# Altium schematic sheet SCH.SchDoc
size A4; SheetNumber: 1; SheetTotal: 1
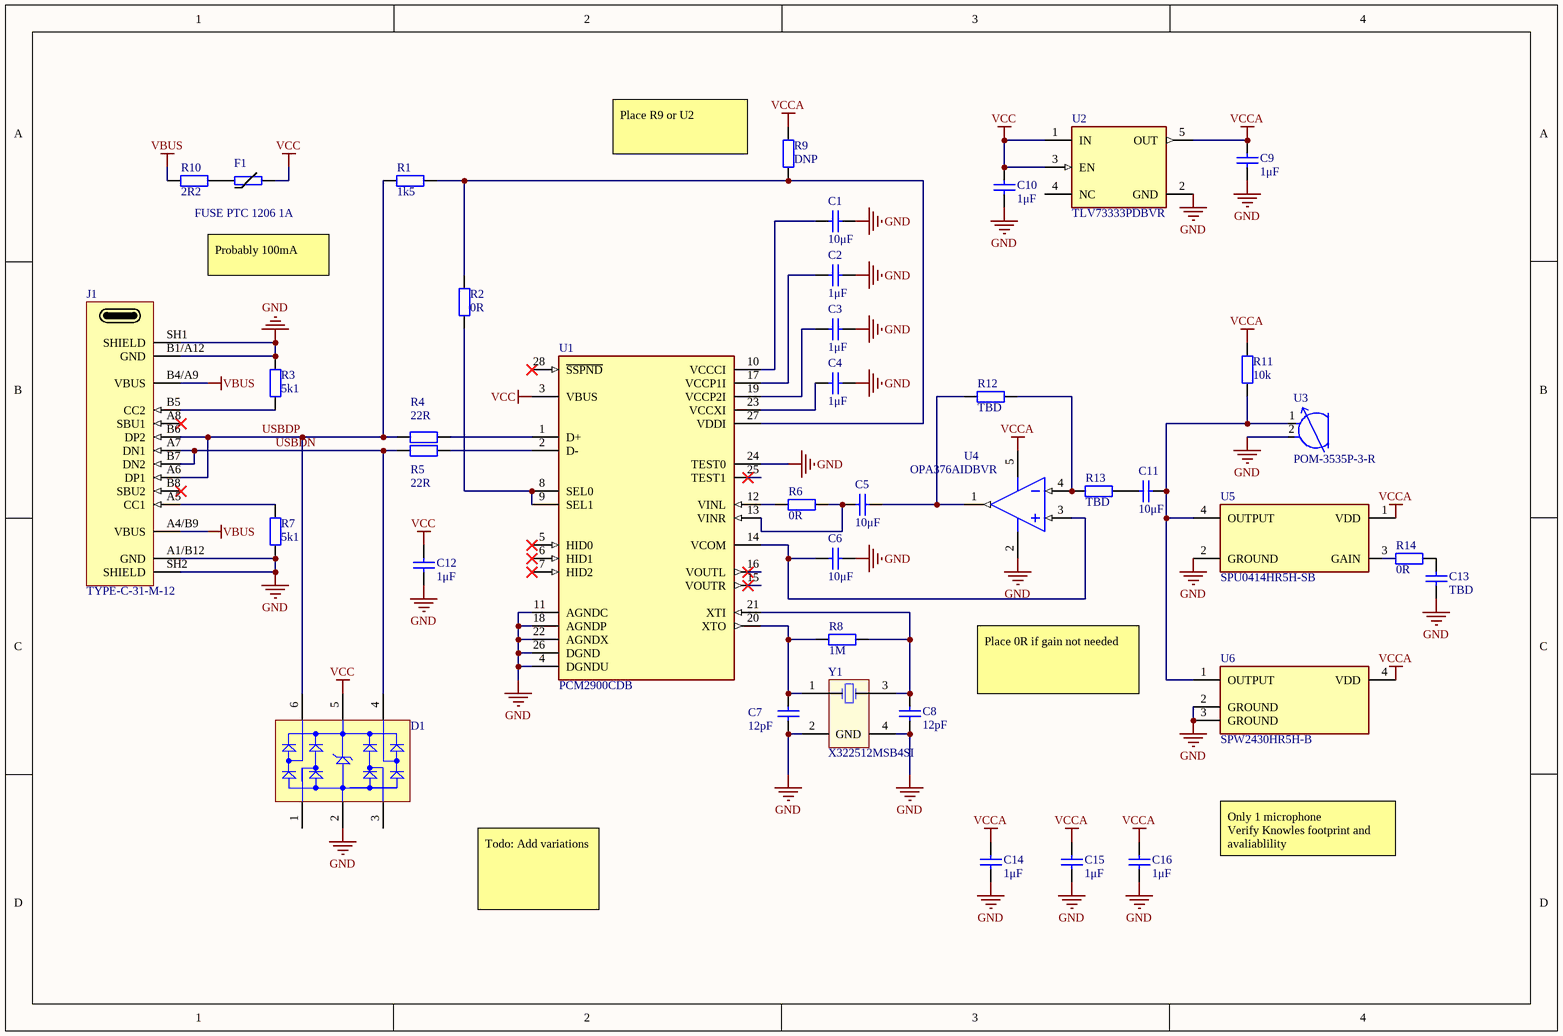
[diagram p0: SCH.SchDoc]

## Parts
C1  value 10μF  [CAPC1206N]  (hidden comment: Cap)
C2  value 1μF  [CAPC0402N]  (hidden comment: Cap)
C3  value 1μF  [CAPC0402N]  (hidden comment: Cap)
C4  value 1μF  [CAPC0402N]  (hidden comment: Cap)
C5  value 10μF  [CAPC1206N]  (hidden comment: Cap)
C6  value 10μF  [CAPC1206N]  (hidden comment: Cap)
C7  value 12pF  [CAPC0402N]  (hidden comment: Cap)
C8  value 12pF  [CAPC0402N]  (hidden comment: Cap)
C9  value 1μF  [CAPC0402N]  (hidden comment: Cap)
C10  value 1μF  [CAPC0402N]  (hidden comment: Cap)
C11  value 10μF  [CAPC1206N]  (hidden comment: Cap)
C12  value 1μF  [CAPC0402N]  (hidden comment: Cap)
C13  value TBD  [CAPC0402N]  (hidden comment: Cap)
C14  value 1μF  [CAPC0402N]  (hidden comment: Cap)
C15  value 1μF  [CAPC0402N]  (hidden comment: Cap)
C16  value 1μF  [CAPC0402N]  (hidden comment: Cap)
D1  (no value)  [SMTC-SOT23-6_V]
F1  FUSE PTC 1206 1A  [FUSE1206N]
J1  TYPE-C-31-M-12  [TYPE-C-31-M-12]
R1  value 1k5  [RESC0402N]  (hidden comment: Res)
R2  value 0R  [RESC0402N]  (hidden comment: Res)
R3  value 5k1  [RESC0402N]  (hidden comment: 5K1 0402)
R4  value 22R  [RESC0402N]  (hidden comment: Res)
R5  value 22R  [RESC0402N]  (hidden comment: Res)
R6  value 0R  [RESC0402N]  (hidden comment: Res)
R7  value 5k1  [RESC0402N]  (hidden comment: 5K1 0402)
R8  value 1M  [RESC0402N]  (hidden comment: Res)
R9  value DNP  [RESC0402N]  (hidden comment: Res)
R10  value 2R2  [RESC0805N]  (hidden comment: Res)
R11  value 10k  [RESC0402N]  (hidden comment: Res)
R12  value TBD  [RESC0402N]  (hidden comment: Res)
R13  value TBD  [RESC0402N]  (hidden comment: Res)
R14  value 0R  [RESC0402N]  (hidden comment: Res)
U1  PCM2900CDB  [FP-DB0028A-IPC_A]
U2  TLV73333PDBVR  [FP-DBV0005A-MFG]
U3  POM-3535P-3-R  [FP-POM-3535P-3-R-MFG]
U4  OPA376AIDBVR  [DBV0005A_L]
U5  SPU0414HR5H-SB  [FP-SPU0414HR5H-SB-MFG]
U6  SPW2430HR5H-B  [FP-SPW2430HR5H-B-MFG]
Y1  X322512MSB4SI  [osccc340x270x100m]

## Nets
GND: C1.2 C2.2 C3.2 C4.2 C6.2 C7.1 C8.1 C9.1 C10.1 C12.1 C13.1 C14.1 C15.1 C16.1 D1.2(GND) J1.A1/B12(GND) J1.B1/A12(GND) J1.SH1(SHIELD) J1.SH2(SHIELD) R3.2 R7.1 U1.4(DGNDU) U1.11(AGNDC) U1.18(AGNDP) U1.22(AGNDX) U1.24(TEST0) U1.26(DGND) U2.2(GND) U3.2(C) U4.2(V-) U5.2(GROUND) U6.2(GROUND) U6.3(GROUND) Y1.2 Y1.4(GND)
VBUS: J1.A4/B9(VBUS) J1.B4/A9(VBUS) R10.1
VCC: C10.2 C12.2 D1.5(VBUS) F1.2 U1.3(VBUS) U2.1(IN) U2.3(EN)
VCCA: C9.2 C14.2 C15.2 C16.2 R9.2 R11.2 U2.5(OUT) U4.5(V+) U5.1(VDD) U6.4(VDD)
USBDN: D1.4(I/O_3) J1.A7(DN1) J1.B7(DN2) R5.1
USBDP: D1.6(I/O_4) J1.A6(DP1) J1.B6(DP2) R1.1 R4.1
NetC1_1: C1.1 U1.10(VCCCI)
NetC2_1: C2.1 U1.17(VCCP1I)
NetC3_1: C3.1 U1.19(VCCP2I)
NetC4_1: C4.1 U1.23(VCCXI)
NetC5_1: C5.1 R6.2 U1.13(VINR)
NetC5_2: C5.2 R12.1 U4.1(OUT)
NetC6_1: C6.1 U1.14(VCOM) U4.3(IN+)
NetC7_2: C7.2 R8.1 U1.20(XTO) Y1.1(OSC1)
NetC8_2: C8.2 R8.2 U1.21(XTI) Y1.3(OSC2)
NetC11_1: C11.1 R13.2
NetC11_2: C11.2 R11.1 U3.1(A) U5.4(OUTPUT) U6.1(OUTPUT)
NetC13_2: C13.2 R14.2
NetF1_1: F1.1 R10.2
NetJ1_A5: J1.A5(CC1) R7.2
NetJ1_B5: J1.B5(CC2) R3.1
NetR1_2: R1.2 R2.2 R9.1 U1.27(VDDI)
NetR2_1: R2.1 U1.8(SEL0) U1.9(SEL1)
NetR4_2: R4.2 U1.1(D+)
NetR5_2: R5.2 U1.2(D-)
NetR6_1: R6.1 U1.12(VINL)
NetR12_2: R12.2 R13.1 U4.4(IN-)
NetR14_1: R14.1 U5.3(GAIN)

Not connected (* = marked no-connect by the designer): D1 1(I/O_1) 3(I/O_2); J1 A8(SBU1)* B8(SBU2)*; U1 5(HID0)* 6(HID1)* 7(HID2)* 15(VOUTR)* 16(VOUTL)* 25(TEST1)* 28(~{SSPND})*; U2 4(NC)

## Notes on the sheet
- (near R9) Place R9 or U2
- Probably 100mA
- Place 0R if gain not needed
- Only 1 microphone
  Verify Knowles footprint and avaliablility
- Todo: Add variations

## Library data of the parts
C1 C5 C6 C11 = C13585: Multilayer Ceramic Capacitors MLCC - SMD/SMT 10uF 50V 1206 RoHS; MFR: CL31A106KBHNNNE; Manufacturer: Samsung Electro-Mechanics; Basic/Extended: B; Temperature Coefficient: X5R; pf: 10000000; LCSC: C13585; Price: 0.055$/unit; Package: 1206; Voltage - Rated: 50V
C2-C4 C9 C10 C12 C14-C16 = C52923: Multilayer Ceramic Capacitors MLCC - SMD/SMT 1uF 25V 0402 RoHS; MFR: CL05A105KA5NQNC; Manufacturer: Samsung Electro-Mechanics; Basic/Extended: B; Temperature Coefficient: X5R; pf: 1000000; LCSC: C52923; Price: 0.007$/unit; Package: 0402; Voltage - Rated: 25V
C7 C8 C13 = C1547: Multilayer Ceramic Capacitors MLCC - SMD/SMT 12pF 50V 0402 RoHS; MFR: 0402CG120J500NT; Manufacturer: Guangdong Fenghua Advanced Tech; Basic/Extended: B; Temperature Coefficient: C0G; pf: 12; LCSC: C1547; Price: 0.003$/unit; Package: 0402; Voltage - Rated: 50V
D1 = CMP-2000-05358-1: RailClamp(R) Low Capacitance TVS Diode Array, 5 pF, 17.5 VC, -55 to 125 degC, 6-Pin SOT23, RoHS, Tape and Reel; Manufacturer: PROTEK DEVICES; MFR: SRV05-4-P-T7; Basic/Extended: B; LCSC: C85364; Package: SOT-23-6L; Price: 0.14
F1 = 0ZCJ0100FF2E: MANUF: Bel Fuse; Manufacturer: BOURNS; MFR: MF-NSMF050-2; DESCIPTION: PTC FUSE 6V 1A 1206; COMPATIBLES: YES; VALUE: 1000 mA; NoPins: 2; Voltage: 6V; SCH: PTC 6V 1A 1206; Basic/Extended: E; MANUFCODE: 0ZCJ0100FF2E; DIGIKEY: 507-1806-2-ND,507-1806-1-ND,507-1806-6-ND; SMD: YES; mA: 1000 mA; LCSC: C75464; Package: 1206
J1 = TYPE-C-31-M-12: USB TYPE-C 2.0 16 PIN SMD; Manufacturer: Korean Hroparts Elec; Basic/Extended: E; LCSC: C165948; MFR: TYPE-C-31-M-12
R1 = C25867: Chip Resistor - Surface Mount 1.5KOhms ±1% 1/16W 0402 RoHS; MFR: 0402WGF1501TCE; Manufacturer: Uniroyal Elec; B/E: B; LCSC: C25867; Package: '0402
R2 R6 R9 R12-R14 = C17168: Chip Resistor - Surface Mount 0Ohms ±1% 1/16W 0402 RoHS; MFR: 0402WGF0000TCE; Manufacturer: Uniroyal Elec; B/E: B; LCSC: C17168; Package: '0402
R3 R7 = C25905: Chip Resistor - Surface Mount 5.1KOhms ±1% 1/16W 0402 RoHS; MFR: 0402WGF5101TCE; Manufacturer: Uniroyal Elec; B/E: B; LCSC: C25905; Package: '0402; Basic/Extended: B
R4 R5 = C25092: Chip Resistor - Surface Mount 22Ohms ±1% 1/16W 0402 RoHS; MFR: 0402WGF220JTCE; Manufacturer: Uniroyal Elec; B/E: B; LCSC: C25092; Package: '0402
R8 = C26083: Chip Resistor - Surface Mount 1MOhms ±1% 1/16W 0402 RoHS; MFR: 0402WGF1004TCE; Manufacturer: Uniroyal Elec; B/E: B; LCSC: C26083; Package: '0402
R10 = C17521: Chip Resistor - Surface Mount 2.2Ohms ±1% 1/8W 0805 RoHS; MFR: 0805W8F220KT5E; Manufacturer: Uniroyal Elec; B/E: B; LCSC: C17521; Package: '0805
R11 = C25744: Chip Resistor - Surface Mount 10KOhms ±1% 1/16W 0402 RoHS; MFR: 0402WGF1002TCE; Manufacturer: Uniroyal Elec; B/E: B; LCSC: C25744; Package: '0402
U1 = CMP-04894-000011-1: IC STEREO AUD CODEC W/USB 28SSOP; Number of Analog Inputs: 2; Interface: USB; Operating Supply Current: 67mA; Sampling Rate: 48KS/s; Max Supply Voltage: 5.25V; Resolution: 16b; Number of A/D Converters: 1; Operating Supply Voltage: 5V; Signal to Noise Ratio (SNR): 89dB; Lead Free: Lead Free; Case/Package: SSOP; Radiation Hardening: No; Number of ADC Channels: 2; Number of Pins: 28; Series: -; Mount: Surface Mount; Max Operating Temperature: 85°C; Min Operating Temperature: -25°C; Type: General Purpose; Weight: 0.009348oz; Number of DAC Channels: 2; Number of Analog Outputs: 2; RoHS Compliant: Yes; Package Quantity: 50; REACH SVHC: No SVHC; Packaging: Rail/Tube; Number of D/A Converters: 1
U2 = CMP-04917-000053-1: IC REG LINEAR 3.3V 300MA SOT23-5; Manufacturer: Texas Instruments; Max Junction Temp: +125°C; Accuracy Percentage: 1%; Min Supply Voltage: 1.4V; Description: Linear Voltage Regulator IC 1 Output 300mA SOT-23-5; Number Of Outputs: 1; Dropout Voltage: 125mV; Nominal Supply Current: 34uA; Max Supply Voltage: 5.5V; Output Type: Fixed; Standoff Height: 0mm; Digikey Description: IC REG LINEAR 3.3V 300MA SOT23-5; Manufacturer Part Number: TLV73333PDBVR; Temperature Range High: +125°C; Temperature: -40°C to +125°C; Output Current: 300mA; Mouser Description: LDO Voltage Regulators Capacitr-Free 300-mA 5-SOT-23 -40 to 125; Automotive: No; Height: 1.45mm; Device Class L3: Voltage Regulators - Linear; ComponentLink2Description: Datasheet; Device Class L1: Integrated Circuits (ICs); ComponentLink2URL: http://www.ti.com/lit/ds/symlink/tlv733p.pdf; Octopart: https://octopart.com/tlv73333pdbvr-texas+instruments-51080890; Temperature Range Low: -40°C; RoHS: TRUE; Lead Free: Yes; Output Voltage: 3.3V; Package: DBV0005A; Device Class L2: Power Management ICs; Category: IC
U3 = CMP-231723-000001-1: MIC COND ANALOG OMNI -35DB 6MM D; Resistance: 2200R; Direction: Omnidirectional; Impedance: 2.2kR; Shape: Round; Voltage Rating: 2V; Operating Supply Current: 500uA; Packaging: Bulk; Height: 3.7mm; Termination: PC Pins; Depth: 3.7mm; Diameter: 6mm; Mount: Through Hole; Package Quantity: 100; Output Type: Analog
U4 = CMP-0272-00842-3: Precision, Low Noise, Low Iq Operational Amplifier, 2.2 to 5.5 V, -40 to 125 degC, 5-pin SOT23 (DBV5), Green (RoHS & no Sb/Br); Manufacturer: Texas Instruments; Offset Drift(Typ)(uV/C): 0.32; Iq per channel(Max)(mA): 0.95; Vn at 1kHz(Typ)(nV/rtHz): 7.5; Total Supply Voltage(Min)(+5V is 5, +/-5V is 10): 2.2; Number of Channels: 1; Slew Rate(Typ)(V/us): 2; CMRR(Min)(dB): 76; Total Supply Voltage(Max)(+5V is 5, +/-5V is 10): 5.5; Vio (25C)(Max)(mV): 0.025; IIB(Max)(pA): 10; Sub Family: Low Input Bias Current Amp (<=10pA), Low Noise Amp (<=10nV/rtHz), Low Offset Voltage Amplifier (<=500uV), Low Supply Voltage Amplifier (<=2.7V), Precision Amplifier; Code_JEDEC: MO-178; DatasheetVersion: SBOS406F; ComponentLink3Description: Package Specification; PackageVersion: 4073253-4/K, 03/2006; ComponentLink2Description: Datasheet; PackageDescription: 5-Pin Plastic Small Outline, Body 1.6 x 2.9 mm, Pitch 0.95 mm; ComponentLink1URL: http://www.ti.com/; Mounting Technology: Surface Mount; PartNumber: OPA376AIDBVR; ComponentLink1Description: Manufacturer URL; ComponentLink3URL: http://www.ti.com/litv/pdf/mpds018i; PackageReference: DBV0005A; ComponentLink2URL: http://www.ti.com/general/docs/lit/getliterature.tsp?genericPartNumber=OPA376&fileType=pdf; Eco-Plan: Green (RoHS & no Sb/Br)
U5 = CMP-95043-000002-1: MICROPHONE MEMS ANALOG OMNI; Operating Supply Voltage: 3.6V; Operating Supply Current: 350uA; Frequency: 100Hz; Shape: Rectangular; Impedance: 400R; Signal to Noise Ratio (SNR): 59dB; Direction: Omnidirectional; Current Rating: 220uA; Depth: 1.2mm; Output Type: Analog; Termination: SMD/SMT; Width: 2.95mm; Height: 1.2mm; Packaging: Tape and Reel; Length: 3.76mm; Voltage Rating: 3.6V; Package Quantity: 1200
U6 = CMP-95043-000004-1: MICROPHONE MEMS ANALOG OMNI; Shape: Rectangular; Impedance: 450R; Direction: Omnidirectional; Operating Supply Current: 110uA; Width: 2.5mm; Output Type: Analog; Height: 1.1mm; Termination: Solder; Length: 3.1mm; Packaging: Tape and Reel
Y1 = X322512MSB4SI: Crystal Oscillator; Manufacturer: Yangxing Tech; Value: 12MHz; LCSC: C9002; MFR.Part #: X322512MSB4SI